# EAGLE schematic Quest Game Schematic (EAGLE 9.7.0)
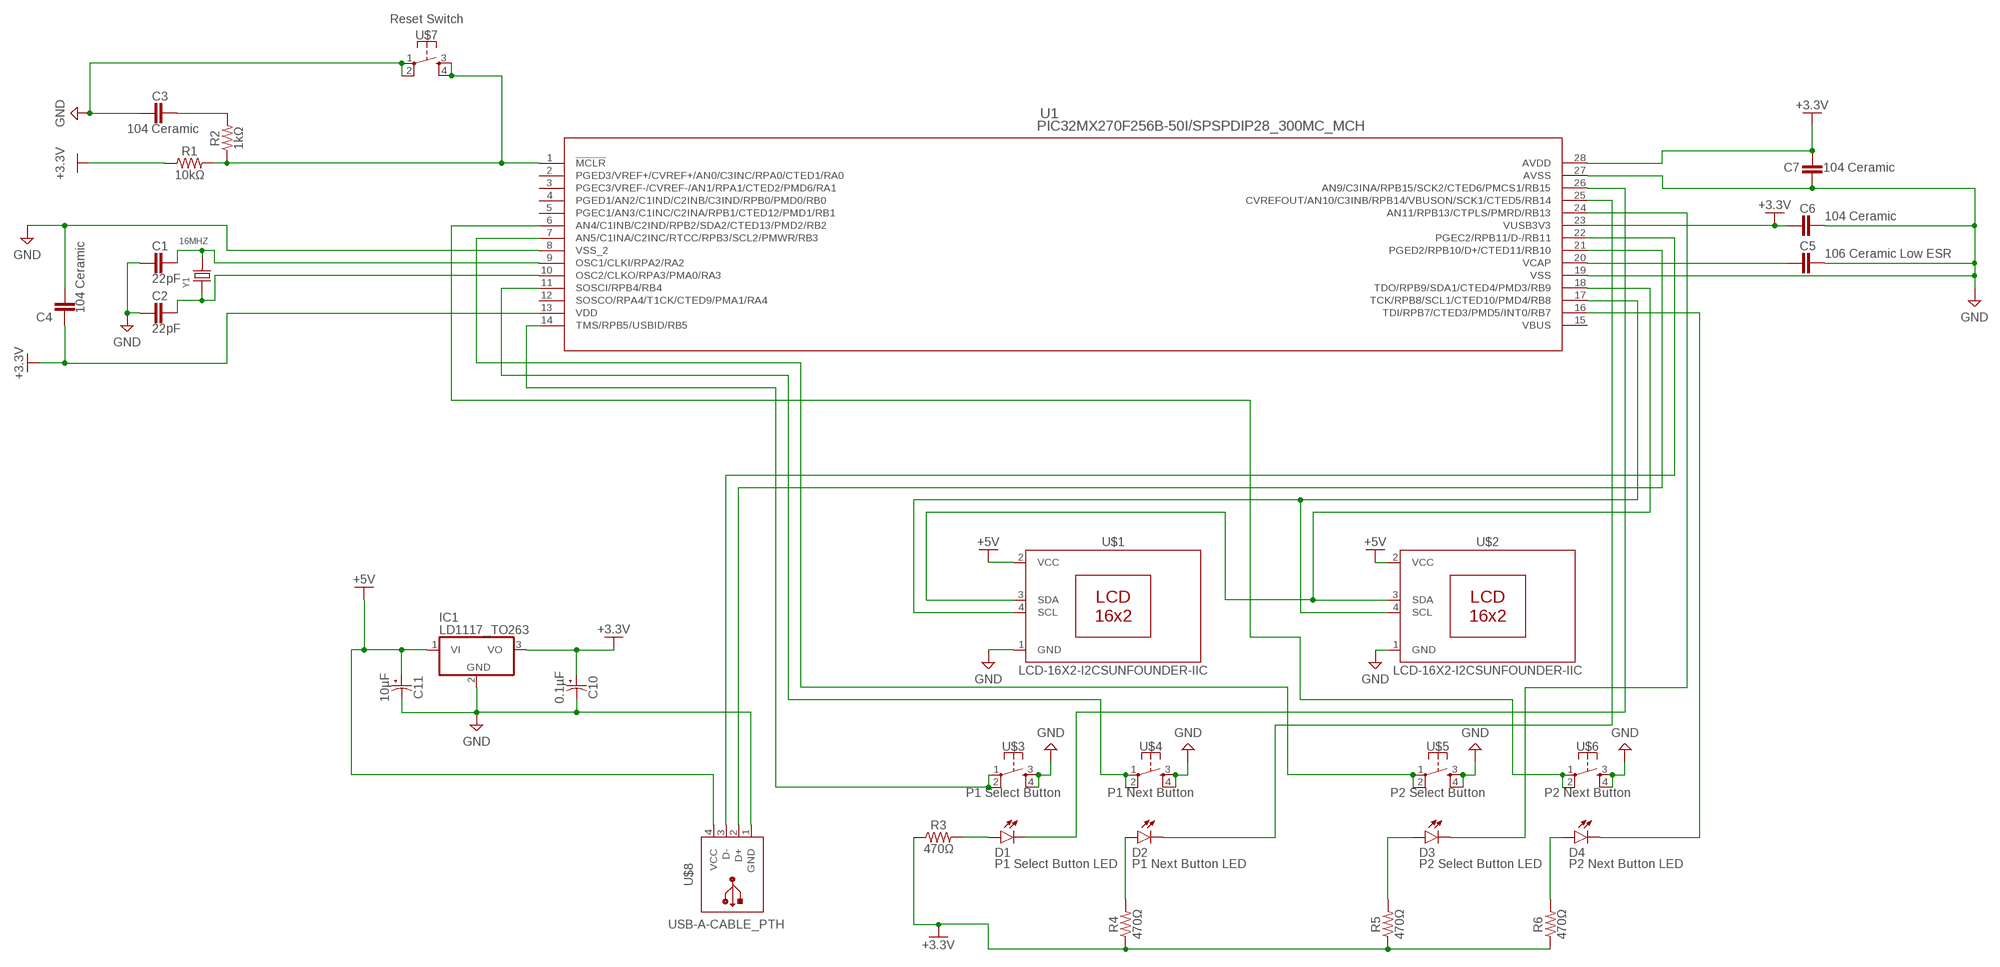
[diagram p0: schematic, sheet 1]

## Parts
C1  22pF  CAPACITORCERAMIC-2.54MM  [CAP-THRU-2.54MM]
C2  22pF  CAPACITORCERAMIC-2.54MM  [CAP-THRU-2.54MM]
C3  104 Ceramic  CAPACITORCERAMIC-2.54MM  [CAP-THRU-2.54MM]
C4  104 Ceramic  CAPACITORCERAMIC-2.54MM  [CAP-THRU-2.54MM]
C5  106 Ceramic Low ESR  CAPACITORCERAMIC-2.54MM  [CAP-THRU-2.54MM]
C6  104 Ceramic  CAPACITORCERAMIC-2.54MM  [CAP-THRU-2.54MM]
C7  104 Ceramic  CAPACITORCERAMIC-2.54MM  [CAP-THRU-2.54MM]
C10  0.1µF  C-POL-USRADIAL-4MM-DIA  [CAPPRD150W80D400H600B]
C11  10µF  C-POL-USRADIAL-4MM-DIA  [CAPPRD150W80D400H600B]
D1  P1 Select Button LED  LED_RADIAL_WHITE  [LEDRD254W60D565H860B_W]
D2  P1 Next Button LED  LED_RADIAL_WHITE  [LEDRD254W60D565H860B_W]
D3  P2 Select Button LED  LED_RADIAL_WHITE  [LEDRD254W60D565H860B_W]
D4  P2 Next Button LED  LED_RADIAL_WHITE  [LEDRD254W60D565H860B_W]
IC1  LD1117_TO263  [TO263-3]
R1  10kΩ  RESISTORAXIAL-0.3  [AXIAL-0.3]
R2  1kΩ  RESISTORAXIAL-0.3  [AXIAL-0.3]
R3  470Ω  1KOHM-HORIZ-1/4W-1%  [AXIAL-0.3]
R4  470Ω  1KOHM-HORIZ-1/4W-1%  [AXIAL-0.3]
R5  470Ω  1KOHM-HORIZ-1/4W-1%  [AXIAL-0.3]
R6  470Ω  1KOHM-HORIZ-1/4W-1%  [AXIAL-0.3]
U1  PIC32MX270F256B-50I/SPSPDIP28_300MC_MCH  [SPDIP28_300MC_MCH]
U$1  LCD-16X2-I2CSUNFOUNDER-IIC  [LCD-I2C]
U$2  LCD-16X2-I2CSUNFOUNDER-IIC  [LCD-I2C]
U$3  P1 Select Button  SWITCH_MOMENTARY  [SWITCH-MOMENTARY-PTH-6.5MM]
U$4  P1 Next Button  SWITCH_MOMENTARY  [SWITCH-MOMENTARY-PTH-6.5MM]
U$5  P2 Select Button  SWITCH_MOMENTARY  [SWITCH-MOMENTARY-PTH-6.5MM]
U$6  P2 Next Button  SWITCH_MOMENTARY  [SWITCH-MOMENTARY-PTH-6.5MM]
U$7  Reset Switch  SWITCH_MOMENTARY  [SWITCH-MOMENTARY-PTH-6.5MM]
U$8  USB-A-CABLE_PTH  [USB-A]
Y1  16MHZ  DIP-CRYSTAL-16MHZ-18PF-30PPM-40R(HC49US)  [HC49US]

## Nets
+3.3V: C4.2 C6.2 C7.1 C10.1(+) IC1.3(VO) R1.P$1 R3.P$1 R4.P$1 R5.P$1 R6.P$1 U1.13(VDD) U1.23(VUSB3V3) U1.28(AVDD)
+5V: C11.1(+) IC1.1(VI) U$1.2(VCC) U$2.2(VCC) U$8.4(VCC)
GND: C1.2 C2.2 C3.2 C4.1 C5.1 C6.1 C7.2 C10.2(-) C11.2(-) IC1.2(GND) U1.8(VSS_2) U1.19(VSS) U1.27(AVSS) U$1.1(GND) U$2.1(GND) U$3.3 U$3.4 U$4.3 U$4.4 U$5.3 U$5.4 U$6.3 U$6.4 U$7.1 U$7.2 U$8.1(GND)
N$1: C1.1 U1.9(OSC1/CLKI/RPA2/RA2) Y1.2
N$2: C2.1 U1.10(OSC2/CLKO/RPA3/PMA0/RA3) Y1.1
N$3: U1.14(TMS/RPB5/USBID/RB5) U$3.1 U$3.2
N$4: C3.1 R2.P$2
N$5: C5.2 U1.20(VCAP)
N$6: R1.P$2 R2.P$1 U1.1(!MCLR) U$7.3 U$7.4
N$7: D3.1(A) R5.P$2
N$8: U1.11(SOSCI/RPB4/RB4) U$4.1 U$4.2
N$9: D4.1(A) R6.P$2
N$10: U1.7(AN5/C1INA/C2INC/RTCC/RPB3/SCL2/PMWR/RB3) U$5.1 U$5.2
N$11: D3.2(C) U1.24(AN11/RPB13/CTPLS/PMRD/RB13)
N$12: U1.6(AN4/C1INB/C2IND/RPB2/SDA2/CTED13/PMD2/RB2) U$6.1 U$6.2
N$13: D4.2(C) U1.16(TDI/RPB7/CTED3/PMD5/INT0/RB7)
N$14: U1.17(TCK/RPB8/SCL1/CTED10/PMD4/RB8) U$1.4(SCL) U$2.4(SCL)
N$15: U1.18(TDO/RPB9/SDA1/CTED4/PMD3/RB9) U$1.3(SDA) U$2.3(SDA)
N$17: U1.21(PGED2/RPB10/D+/CTED11/RB10) U$8.2(D+)
N$18: U1.22(PGEC2/RPB11/D-/RB11) U$8.3(D-)
N$19: D1.2(C) U1.26(AN9/C3INA/RPB15/SCK2/CTED6/PMCS1/RB15)
N$20: D1.1(A) R3.P$2
N$21: D2.1(A) R4.P$2
N$22: D2.2(C) U1.25(CVREFOUT/AN10/C3INB/RPB14/VBUSON/SCK1/CTED5/RB14)
Unconnected: U1.2(PGED3/VREF+/CVREF+/AN0/C3INC/RPA0/CTED1/RA0) U1.3(PGEC3/VREF-/CVREF-/AN1/RPA1/CTED2/PMD6/RA1) U1.4(PGED1/AN2/C1IND/C2INB/C3IND/RPB0/PMD0/RB0) U1.5(PGEC1/AN3/C1INC/C2INA/RPB1/CTED12/PMD1/RB1) U1.12(SOSCO/RPA4/T1CK/CTED9/PMA1/RA4)

## Power pins joined to a net without a drawn wire
VBUS: U1.15(VBUS)

## Library data of the parts
C1-C7 = Tinkercad:CAPACITOR: Capacitor - Generic
C10 C11 = Capacitor:C-POL-US: Capacitor Polarised - ANSI
D1-D4 = Tinkercad:LED_RADIAL: LED - Generic
IC1 = Tinkercad:LD1117: LM2937-2.5, LM2937-3.3 400mA and 500mA Voltage Regulators Source: http://cache.national.com/ds/LM/LM2937-2.5.pdf
R1 R2 = SparkFun-Resistors:RESISTOR: Generic Resistor Package
R3-R6 = SparkFun-Resistors:1KOHM: 1kΩ resistor A resistor is a passive two-terminal electrical component that implements electrical resistance as a circuit element. Resistors act to reduce current flow, and, at the same time, act to lower voltage levels within circuits. - Wikipedia
U1 = 2026-07-08_23-41-48_Library:PIC32MX270F256B-50I/SP
U$1 U$2 = Tinkercad:LCD-16X2-I2C
U$3-U$7 = Tinkercad:SWITCH_MOMENTARY
U$8 = Tinkercad:USB-A-CABLE
Y1 = OPL_Crystal Oscillator:DIP-CRYSTAL-16MHZ-18PF-30PPM-40R(HC49US): 306010014